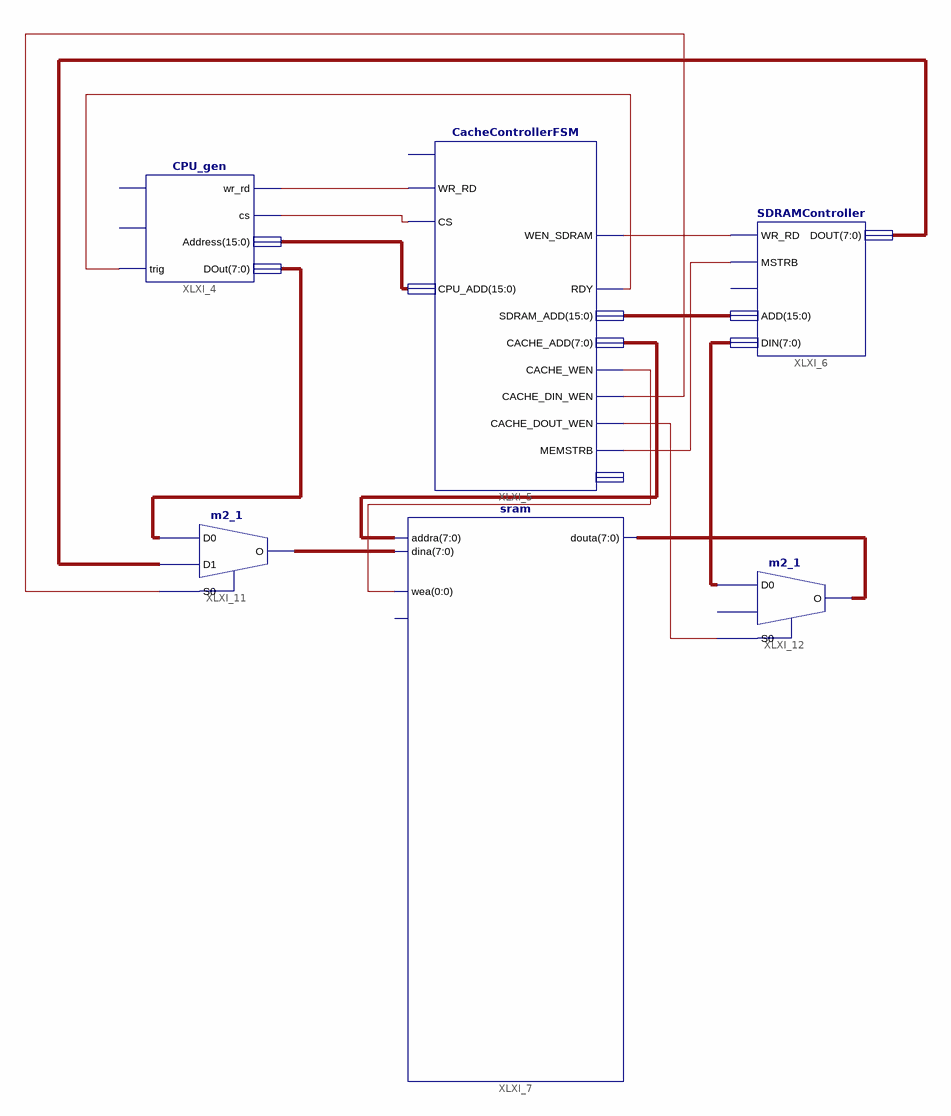
[diagram p0: schematic sheet 1]
// Xilinx ISE schematic main_schematic.sch (spartan3e) as structural Verilog: 6 symbols, 0 ports
module main_schematic (
);

  wire XLXN_1, XLXN_2, XLXN_4, XLXN_6, XLXN_15, XLXN_16, XLXN_20;
  wire [0:0] XLXN_9;
  wire [7:0] XLXN_8, XLXN_12, XLXN_13, XLXN_14, XLXN_18, XLXN_19;
  wire [15:0] XLXN_3, XLXN_5;

  CPU_gen XLXI_4 (.trig(XLXN_6), .wr_rd(XLXN_1), .cs(XLXN_2), .Address(XLXN_3), .DOut(XLXN_13));  // open: clk, rst
  CacheControllerFSM XLXI_5 (
    .WR_RD(XLXN_1), .CS(XLXN_2), .CPU_ADD(XLXN_3), .CACHE_WEN(XLXN_9[0]), .CACHE_DIN_WEN(XLXN_15),
    .CACHE_DOUT_WEN(XLXN_16), .WEN_SDRAM(XLXN_4), .RDY(XLXN_6), .SDRAM_ADD(XLXN_5), .CACHE_ADD(XLXN_8),
    .MEMSTRB(XLXN_20));  // open: clk, DEBUG
  SDRAMController XLXI_6 (.WR_RD(XLXN_4), .MSTRB(XLXN_20), .ADD(XLXN_5), .DIN(XLXN_19), .DOUT(XLXN_14));  // open: Clk
  sram XLXI_7 (.addra(XLXN_8), .dina(XLXN_12), .wea(XLXN_9[0]), .douta(XLXN_18));  // open: clka
  m2_1 XLXI_11 (.D0(XLXN_13), .D1(XLXN_14), .S0(XLXN_15), .O(XLXN_12));
  m2_1 XLXI_12 (.D0(XLXN_19), .S0(XLXN_16), .O(XLXN_18));  // open: D1
endmodule
